# EAGLE design tinyi2c (EAGLE 7.5.0)
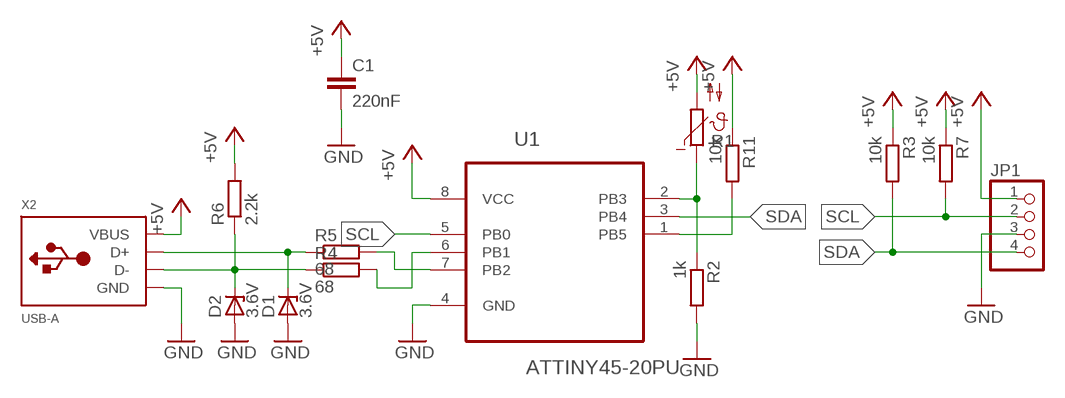
[diagram p0: schematic, sheet 1]

## Parts
C1  220nF  C-EU075-032X103  [C075-032X103]
D1  3.6V  ZENER-DIODEZD-2.5  [ZDIO-2.5]
D2  3.6V  ZENER-DIODEZD-5  [ZDIO-5]
JP1  PINHD-1X4  [1X04]
R1  B57164  [B57164]
R2  1k  R-EU_0207/10  [0207/10]
R3  10k  R-EU_0207/10  [0207/10]
R4  68  R-EU_0204/5  [0204/5]
R5  68  R-EU_0204/5  [0204/5]
R6  2.2k  R-EU_0204/2V  [0204V]
R7  10k  R-EU_0204/2V  [0204V]
R11  10k  R-EU_0204/7  [0204/7]
U1  ATTINY45-20PU  [DIP254P762X533-8]
X2  USB-A  [MOLEX_480371000]

## Nets
+5V: C1.1 JP1.1 R1.2 R3.1 R6.2 R7.1 R11.1 U1.8(VCC) X2.1(VBUS)
GND: C1.2 D1.A D2.A JP1.3 R2.2 U1.4(GND) X2.4(GND)
N$1: R1.1 R2.1 U1.2(PB3)
N$3: R4.2 U1.6(PB1)
N$4: R5.2 U1.7(PB2)
N$9: R11.2 U1.1(PB5)
N$10: D1.C R5.1 X2.3(D+)
N$11: D2.C R4.1 R6.1 X2.2(D-)
SCL: JP1.2 R7.2 U1.5(PB0)
SDA: JP1.4 R3.2 U1.3(PB4)

## Library data of the parts
C1 = rcl:C-EU: CAPACITOR, European symbol
D1 D2 = diode:ZENER-DIODE: Z-Diode
JP1 = pinhead:PINHD-1X4: PIN HEADER
R1 = ptc-ntc:B57164: SIEMENS NTC; MPN: B57164K474K52; OC_FARNELL: 9753451; OC_NEWARK: 29M3118
R2-R7 R11 = rcl:R-EU_: RESISTOR, European symbol
U1 = Atmel_By_element14_Batch_1-00:ATTINY45-20PU: 8-bit Microcontroller with 2/4/8KBytes In-System Programmable Flash; MPN: ATTINY45-20PU; OC_FARNELL: 1288352; OC_NEWARK: 23M5072; PACKAGE: PDIP-8; SUPPLIER: Atmel
X2 = adafruit:USB-A: USB type A 'plug' Used for things that can directly connect to a USB port, say USB key

## Board
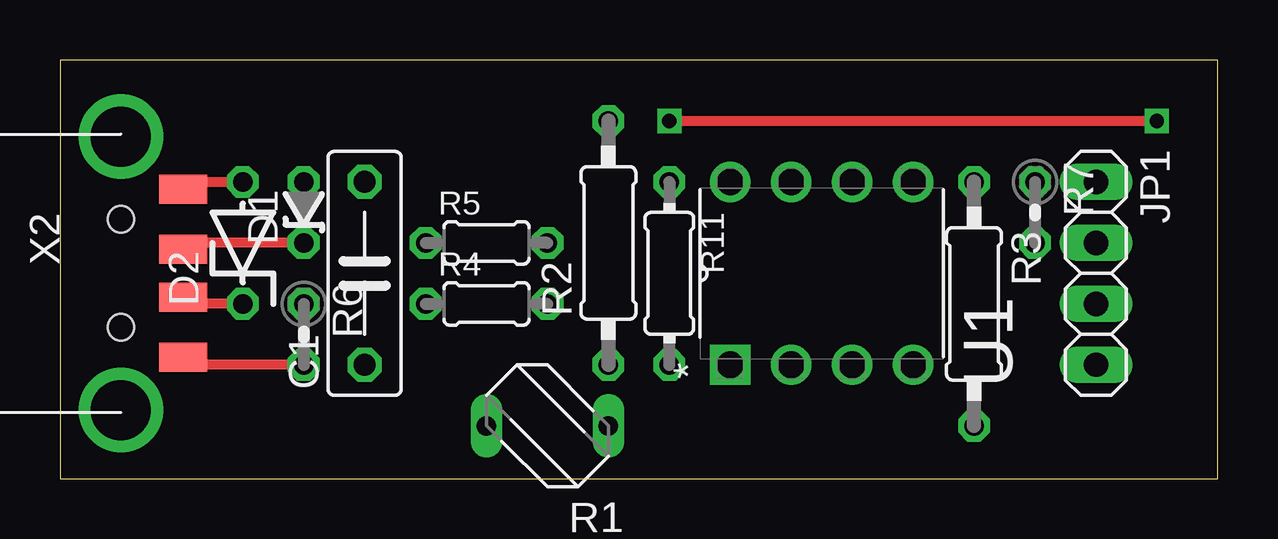
[diagram p1: board, top side]
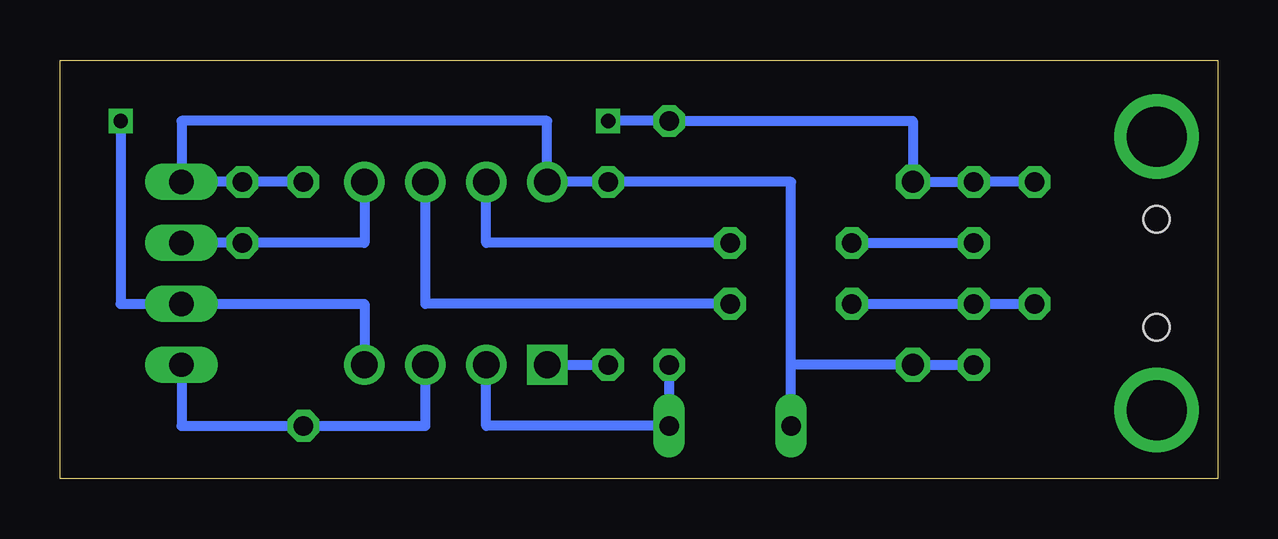
[diagram p2: board, bottom side, seen from below]

Size 48.25 x 17.45 mm. Coordinates in mm from the lower left corner, seen from the top.
Outline: 0,17.45 0,0 48.25,0 48.25,17.45 0,17.45
Copper layers (1*16): Top 0.035mm / dielectric 1.5mm / Bottom 0.035mm
Design rules "default": minimum track width 10mil, minimum drill 24mil, track to track 8mil, track to pad 8mil, pad to pad 8mil, via to via 8mil, smd to smd 8mil, copper to edge 40mil, drill to drill 8mil, minimum pad ring 10mil, minimum via ring 8mil, stop-mask expansion 4mil, vias tented up to drill 0mil, thermal gap 10mil

### Footprints (pad centres in the part's own frame; a part is rotated, then mirrored left to right if it is on the bottom)
C075-032X103 = drill 0.914 octagon: 1 -3.81,0; 2 3.81,0
ZDIO-2.5 = drill 0.813 octagon: A 1.27,0; C -1.27,0
ZDIO-5 = drill 0.813 octagon: A 2.54,0; C -2.54,0
1X04 = drill 1.016 long: 1 -3.81,0; 2 -1.27,0; 3 1.27,0; 4 3.81,0
B57164 = drill 0.813 long: 1 -2.54,0; 2 2.54,0
0207/10 = drill 0.813 octagon: 1 -5.08,0; 2 5.08,0
0204/5 = drill 0.813 octagon: 1 -2.54,0; 2 2.54,0
0204V = drill 0.813 octagon: 1 -1.27,0; 2 1.27,0
0204/7 = drill 0.813 octagon: 1 -3.81,0; 2 3.81,0
DIP254P762X533-8 = drill 1.118 square: 1 -7.62,7.62 | drill 1.118: 2 -7.62,5.08; 3 -7.62,2.54; 4 -7.62,0; 5 0,0; 6 0,2.54; 7 0,5.08; 8 0,7.62
MOLEX_480371000 = smd 1.2 x 2: 1 3.5,2.6; 2 1,2.6; 3 -1,2.6; 4 -3.5,2.6 | drill 2.5: M1 -5.7,0; M2 5.7,0 | hole 1.1: -2.25,0; 2.25,0

### Placement (x,y rotation side)
C1  12.7,8.56 90 top
D1  10.16,11.1 90 top
D2  7.62,9.83 90 top
JP1  43.18,8.56 270 top
R1  20.32,2.21 180 top
R2  22.86,9.83 90 top
R3  38.1,7.29 270 top
R4  17.78,7.29 0 top
R5  17.78,9.83 0 top
R6  10.16,6.02 270 top
R7  40.64,11.1 270 top
R11  25.4,8.56 270 top
U1  35.56,12.37 90 top
X2  2.54,8.56 270 top

### Tracks (layer width: path | path; a pad name or v marks a point on that pad's centre or on a via)
+5V
  Top 0.406: R6.2 5.14,4.75 X2.1
  Bottom 0.406: 17.78,4.75 C1.1 R6.2 | 17.78,4.75 17.78,12.37 R11.1 U1.8 27.94,14.91 43.18,14.91 JP1.1 R7.1 R3.1 | R1.2 17.78,4.75
GND  (via drill 0.6)
  Top 0.406: X2.4 5.08,12.06 5.08,12.37 D2.A | v25.4,14.91 v45.72,14.91
  Bottom 0.406: D2.A D1.A C1.2 12.7,14.91 R2.2 v25.4,14.91 | U1.4 35.56,7.29 JP1.3 45.72,7.29 v45.72,14.91
N$1
  Bottom 0.406: R2.1 R1.1 30.48,2.21 U1.2
N$3
  Bottom 0.406: R4.2 33.02,7.29 U1.6
N$4
  Bottom 0.406: R5.2 30.48,9.83 U1.7
N$9
  Bottom 0.406: U1.1 R11.2
N$10
  Top 0.406: D1.C 5.14,9.83 X2.3
  Bottom 0.406: R5.1 D1.C
N$11
  Top 0.406: D2.C 5.14,7.29 X2.2
  Bottom 0.406: R6.1 D2.C R4.1
SCL
  Bottom 0.406: U1.5 35.56,9.83 R7.2 41.91,9.83 JP1.2
SDA
  Bottom 0.406: JP1.4 43.18,2.21 R3.2 36.83,2.21 33.02,2.21 U1.3